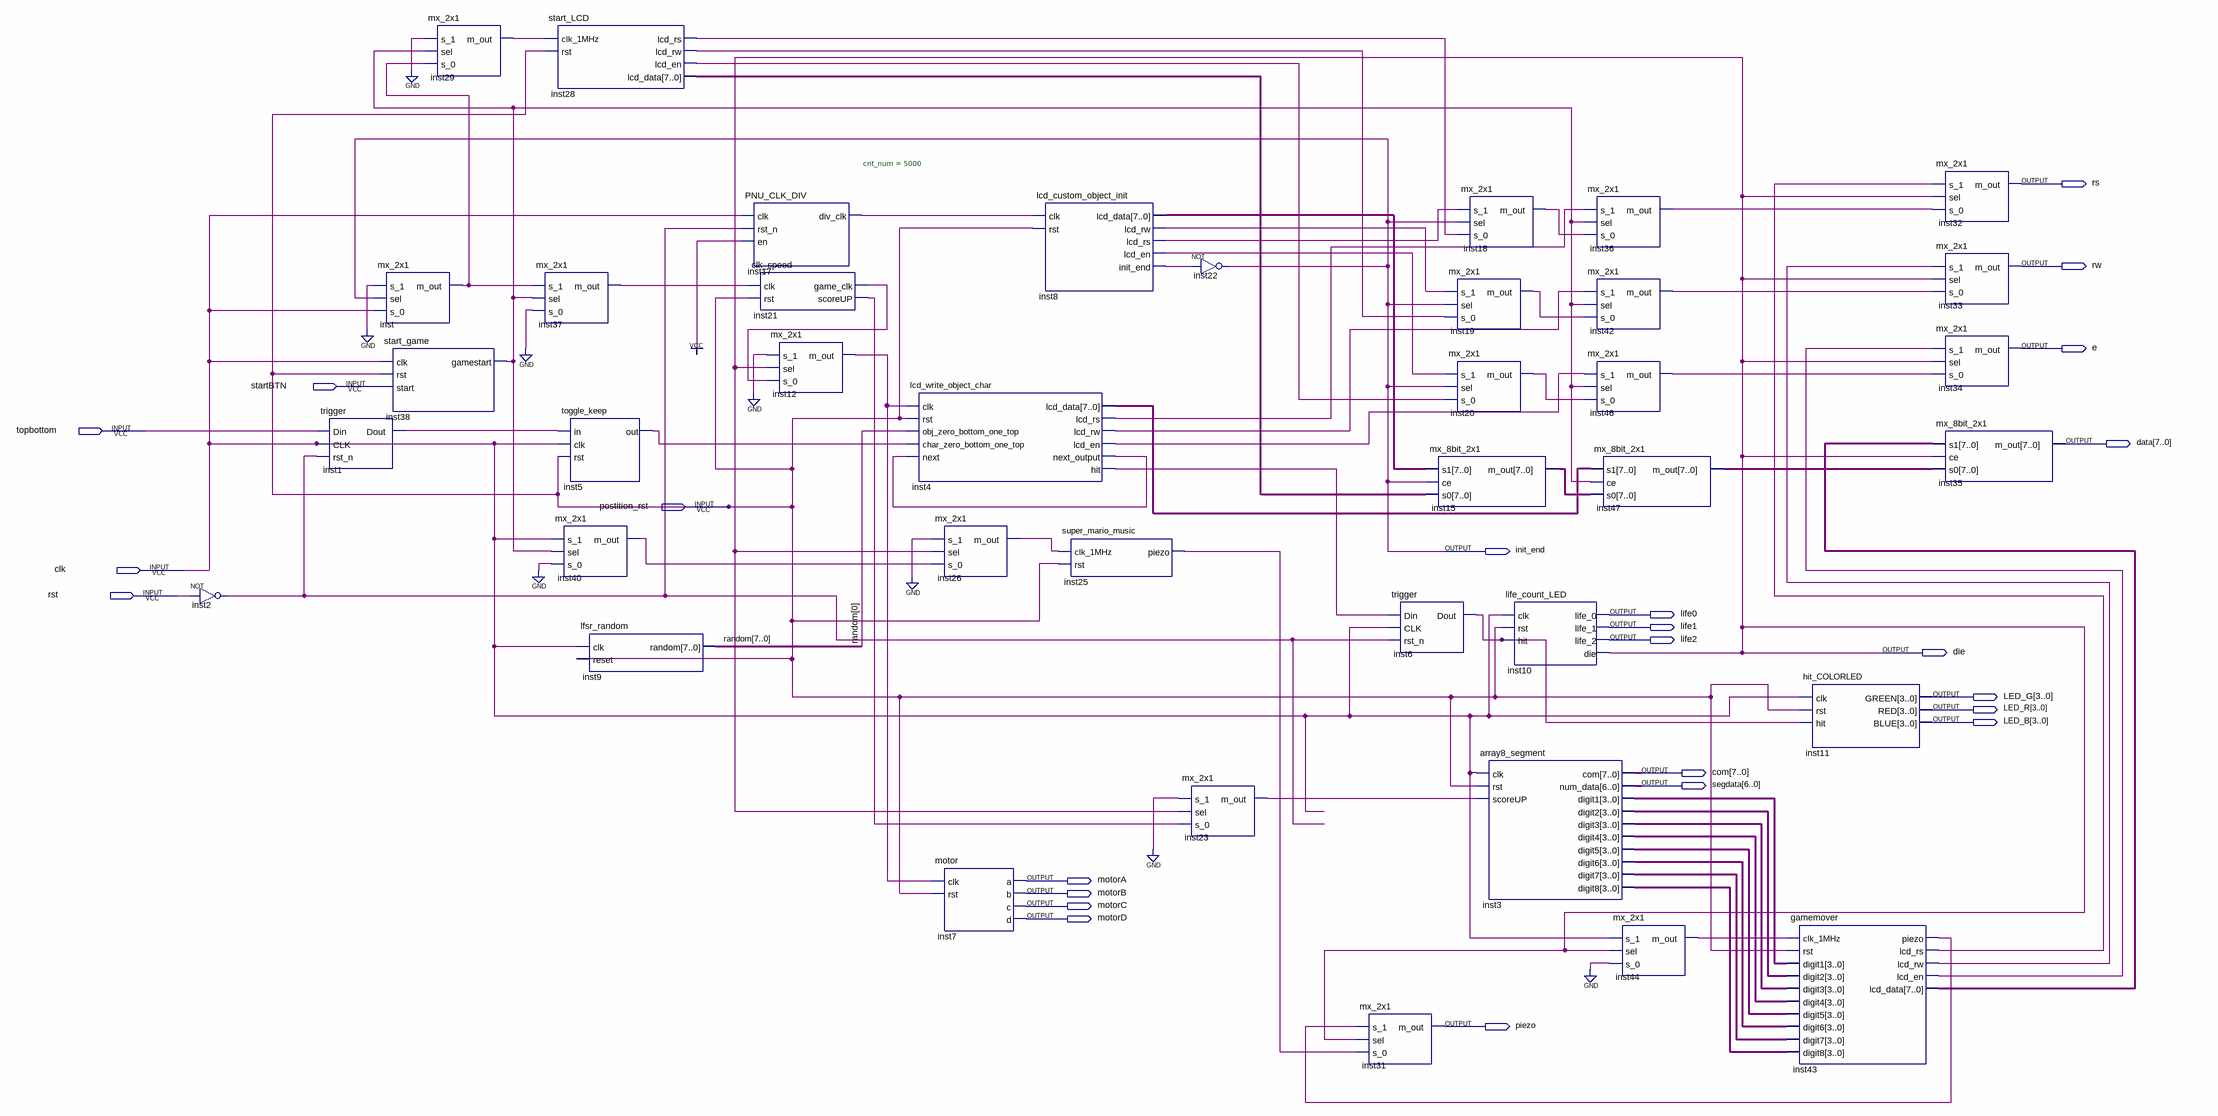
[diagram p0: schematic sheet]
// Quartus schematic main_test.bdf as structural Verilog: 39 symbols, 24 pins
module main_test (
  input  startBTN,
  input  topbottom,
  input  postition_rst,
  input  clk,
  input  rst,
  output rs,
  output rw,
  output e,
  output [7:0] data,
  output init_end,
  output life0,
  output life1,
  output life2,
  output die,
  output [3:0] LED_G,
  output [3:0] LED_R,
  output [3:0] LED_B,
  output [7:0] com,
  output [6:0] segdata,
  output motorA,
  output motorB,
  output motorC,
  output motorD,
  output piezo
);

  wire inst1_dout, inst2_out, inst4_hit, inst4_lcd_en, inst4_lcd_rs, inst4_lcd_rw, inst4_next_output,
       inst5_out, inst6_dout, inst8_init_end, inst8_lcd_en, inst8_lcd_rs, inst8_lcd_rw, inst12_m_out,
       inst17_div_clk, inst18_m_out, inst19_m_out, inst20_m_out, inst21_game_clk, inst21_scoreup,
       inst23_m_out, inst25_piezo, inst26_m_out, inst28_lcd_en, inst28_lcd_rs, inst28_lcd_rw, inst29_m_out,
       inst36_m_out, inst37_m_out, inst38_gamestart, inst40_m_out, inst42_m_out, inst43_lcd_en,
       inst43_lcd_rs, inst43_lcd_rw, inst43_piezo, inst44_m_out, inst46_m_out, inst_m_out;
  wire [3:0] inst3_digit1, inst3_digit2, inst3_digit3, inst3_digit4, inst3_digit5, inst3_digit6,
       inst3_digit7, inst3_digit8;
  wire [7:0] inst4_lcd_data, inst8_lcd_data, inst15_m_out, inst28_lcd_data, inst43_lcd_data, inst47_m_out,
       random;

  not inst2 (inst2_out, rst);
  trigger inst1 (.Din(topbottom), .CLK(clk), .rst_n(inst2_out), .Dout(inst1_dout));
  mx_2x1 inst (.s_1(1'b0), .sel(init_end), .s_0(clk), .m_out(inst_m_out));
  mx_2x1 inst29 (.s_1(1'b0), .sel(inst38_gamestart), .s_0(inst_m_out), .m_out(inst29_m_out));
  start_game inst38 (.clk(clk), .rst(postition_rst), .start(startBTN), .gamestart(inst38_gamestart));
  start_LCD inst28 (
    .clk_1MHz(inst29_m_out), .rst(postition_rst), .lcd_rs(inst28_lcd_rs), .lcd_rw(inst28_lcd_rw),
    .lcd_en(inst28_lcd_en), .lcd_data(inst28_lcd_data));
  mx_2x1 inst37 (.s_1(inst_m_out), .sel(inst38_gamestart), .s_0(1'b0), .m_out(inst37_m_out));
  toggle_keep inst5 (.in(inst1_dout), .clk(clk), .rst(postition_rst), .out(inst5_out));
  mx_2x1 inst40 (.s_1(clk), .sel(inst38_gamestart), .s_0(1'b0), .m_out(inst40_m_out));
  lfsr_random inst9 (.clk(clk), .reset(postition_rst), .random(random));
  PNU_CLK_DIV #(.cnt_num(5000)) inst17 (.clk(clk), .rst_n(inst2_out), .en(1'b1), .div_clk(inst17_div_clk));
  clk_speed inst21 (.clk(inst37_m_out), .rst(postition_rst), .game_clk(inst21_game_clk), .scoreUP(inst21_scoreup));
  mx_2x1 inst12 (.s_1(1'b0), .sel(die), .s_0(inst21_game_clk), .m_out(inst12_m_out));
  lcd_write_object_char inst4 (
    .clk(inst12_m_out), .rst(postition_rst), .obj_zero_bottom_one_top(random[0]),
    .char_zero_bottom_one_top(inst5_out), .next(inst4_next_output), .lcd_data(inst4_lcd_data),
    .lcd_rs(inst4_lcd_rs), .lcd_rw(inst4_lcd_rw), .lcd_en(inst4_lcd_en), .next_output(inst4_next_output),
    .hit(inst4_hit));
  mx_2x1 inst26 (.s_1(1'b0), .sel(die), .s_0(inst40_m_out), .m_out(inst26_m_out));
  motor inst7 (.clk(inst12_m_out), .rst(postition_rst), .a(motorA), .b(motorB), .c(motorC), .d(motorD));
  lcd_custom_object_init inst8 (
    .clk(inst17_div_clk), .rst(postition_rst), .lcd_data(inst8_lcd_data), .lcd_rw(inst8_lcd_rw),
    .lcd_rs(inst8_lcd_rs), .lcd_en(inst8_lcd_en), .init_end(inst8_init_end));
  super_mario_music inst25 (.clk_1MHz(inst26_m_out), .rst(postition_rst), .piezo(inst25_piezo));
  mx_2x1 inst23 (.s_1(1'b0), .sel(die), .s_0(inst21_scoreup), .m_out(inst23_m_out));
  not inst22 (init_end, inst8_init_end);
  trigger inst6 (.Din(inst4_hit), .CLK(clk), .rst_n(inst2_out), .Dout(inst6_dout));
  mx_2x1 inst31 (.s_1(inst43_piezo), .sel(die), .s_0(inst25_piezo), .m_out(piezo));
  mx_8bit_2x1 inst15 (.s1(inst8_lcd_data), .ce(init_end), .s0(inst28_lcd_data), .m_out(inst15_m_out));
  mx_2x1 inst18 (.s_1(inst8_lcd_rs), .sel(init_end), .s_0(inst28_lcd_rs), .m_out(inst18_m_out));
  mx_2x1 inst19 (.s_1(inst8_lcd_rw), .sel(init_end), .s_0(inst28_lcd_rw), .m_out(inst19_m_out));
  mx_2x1 inst20 (.s_1(inst8_lcd_en), .sel(init_end), .s_0(inst28_lcd_en), .m_out(inst20_m_out));
  array8_segment inst3 (
    .clk(clk), .rst(postition_rst), .scoreUP(inst23_m_out), .com(com), .num_data(segdata),
    .digit1(inst3_digit1), .digit2(inst3_digit2), .digit3(inst3_digit3), .digit4(inst3_digit4),
    .digit5(inst3_digit5), .digit6(inst3_digit6), .digit7(inst3_digit7), .digit8(inst3_digit8));
  life_count_LED inst10 (
    .clk(clk), .rst(postition_rst), .hit(inst6_dout), .life_0(life0), .life_1(life1), .life_2(life2),
    .die(die));
  mx_2x1 inst36 (.s_1(inst4_lcd_rs), .sel(inst38_gamestart), .s_0(inst18_m_out), .m_out(inst36_m_out));
  mx_2x1 inst42 (.s_1(inst4_lcd_rw), .sel(inst38_gamestart), .s_0(inst19_m_out), .m_out(inst42_m_out));
  mx_2x1 inst46 (.s_1(inst4_lcd_en), .sel(inst38_gamestart), .s_0(inst20_m_out), .m_out(inst46_m_out));
  mx_8bit_2x1 inst47 (.s1(inst4_lcd_data), .ce(inst38_gamestart), .s0(inst15_m_out), .m_out(inst47_m_out));
  mx_2x1 inst44 (.s_1(clk), .sel(die), .s_0(1'b0), .m_out(inst44_m_out));
  gamemover inst43 (
    .clk_1MHz(inst44_m_out), .rst(postition_rst), .digit1(inst3_digit1), .digit2(inst3_digit2),
    .digit3(inst3_digit3), .digit4(inst3_digit4), .digit5(inst3_digit5), .digit6(inst3_digit6),
    .digit7(inst3_digit7), .digit8(inst3_digit8), .piezo(inst43_piezo), .lcd_rs(inst43_lcd_rs),
    .lcd_rw(inst43_lcd_rw), .lcd_en(inst43_lcd_en), .lcd_data(inst43_lcd_data));
  hit_COLORLED inst11 (.clk(clk), .rst(postition_rst), .hit(inst6_dout), .GREEN(LED_G), .RED(LED_R), .BLUE(LED_B));
  mx_2x1 inst32 (.s_1(inst43_lcd_rs), .sel(die), .s_0(inst36_m_out), .m_out(rs));
  mx_2x1 inst33 (.s_1(inst43_lcd_rw), .sel(die), .s_0(inst42_m_out), .m_out(rw));
  mx_2x1 inst34 (.s_1(inst43_lcd_en), .sel(die), .s_0(inst46_m_out), .m_out(e));
  mx_8bit_2x1 inst35 (.s1(inst43_lcd_data), .ce(die), .s0(inst47_m_out), .m_out(data));
endmodule
